# EAGLE design LCD (EAGLE 7.6.0)
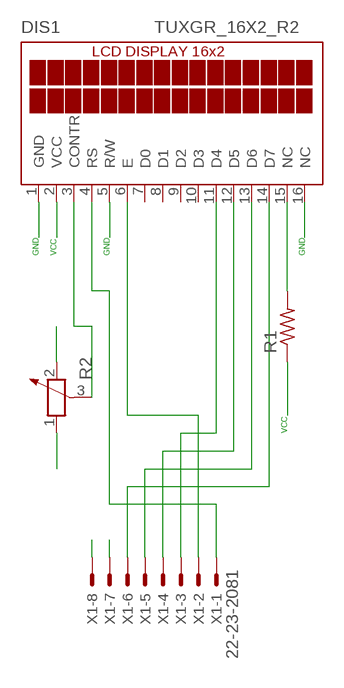
[diagram p0: schematic, sheet 1]

## Parts
DIS1  TUXGR_16X2_R2  [TUXGR_16X2_R2]
R1  R-US_0204/7  [0204/7]
R2  POTENTIOMETER_PT-10  [PT-10]
X1  22-23-2081  [22-23-2081]

## Nets
GND: DIS1.1(GND) DIS1.5(R/W) DIS1.16(NC) R2.1 X1.7
N$1: DIS1.3(CONTR) R2.3
N$2: DIS1.15(NC) R1.2
N$3: DIS1.14(D7) X1.6
N$4: DIS1.13(D6) X1.5
N$5: DIS1.12(D5) X1.4
N$6: DIS1.11(D4) X1.3
N$7: DIS1.6(E) X1.2
N$8: DIS1.4(RS) X1.1
VCC: DIS1.2(VCC) R1.1 R2.2 X1.8
Unconnected: DIS1.7(D0) DIS1.8(D1) DIS1.9(D2) DIS1.10(D3)

## Notes on the sheet
- GND | VCC | GND | GND
- VCC

## Library data of the parts
DIS1 = display-lcd:TUXGR_16X2_R2: Tuxgraphics LCD display 16x2 characters reflective, without background light Source: tuxgr_12x2_r2.pdf; OC_FARNELL: unknown; OC_NEWARK: unknown
R1 = resistor:R-US_: RESISTOR, American symbol
R2 = rcl:POTENTIOMETER_: Potentiometer
X1 = con-molex:22-23-2081: .100" (2.54mm) Center Header - 8 Pin; MF: MOLEX; MPN: 22-23-2081; OC_FARNELL: 1756826; OC_NEWARK: 01C7592

## Net classes
0 default: width 1.016 mm, drill 1.016 mm, clearance 1.016 mm

## Board
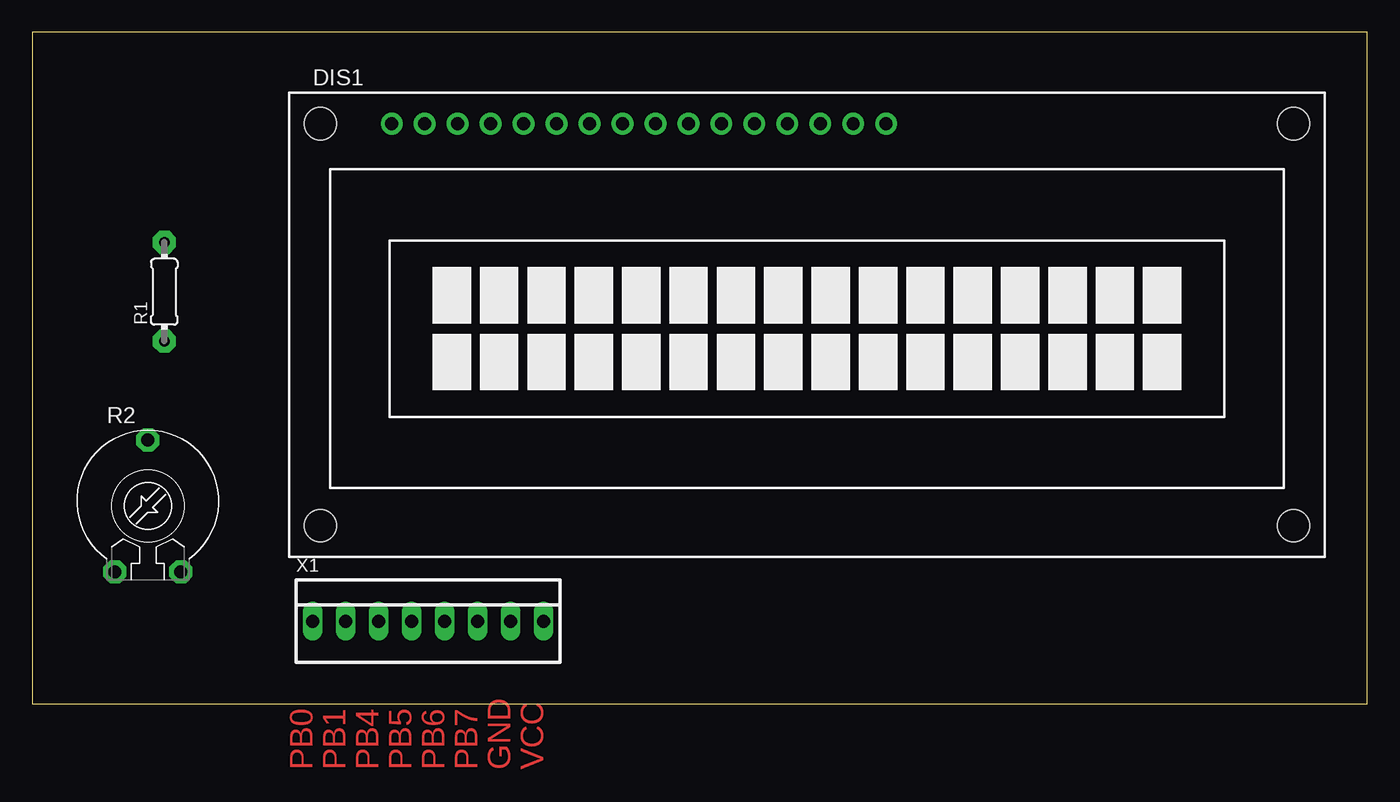
[diagram p1: board, top side]
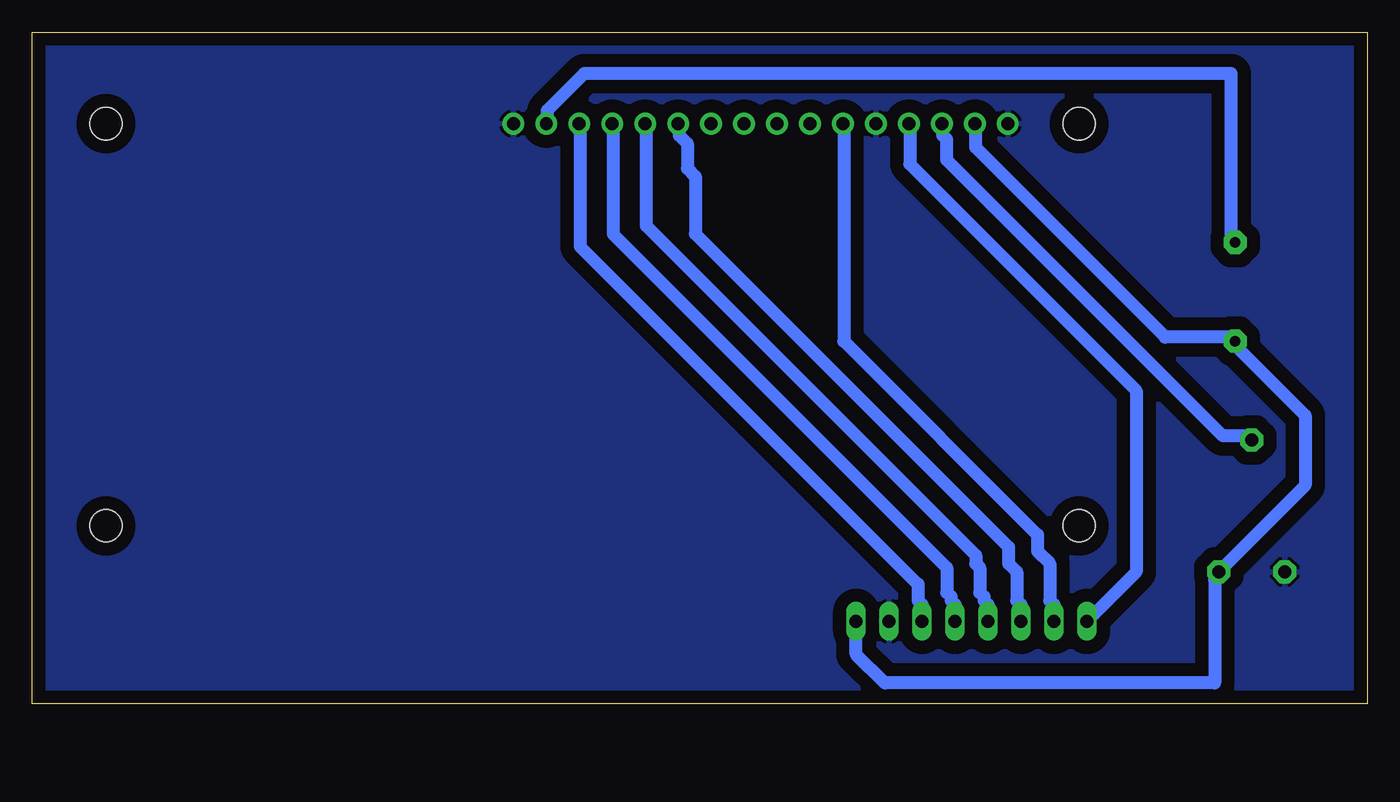
[diagram p2: board, bottom side, seen from below]

Size 102.85 x 51.74 mm. Coordinates in mm from the lower left corner, seen from the top.
Outline: 0,0 102.85,0 102.85,51.74 0,51.74 0,0
Copper layers (1*16): Top 0.035mm / dielectric 1.5mm / Bottom 0.035mm
Design rules "default": minimum track width 10mil, minimum drill 24mil, track to track 8mil, track to pad 8mil, pad to pad 8mil, via to via 8mil, smd to smd 8mil, copper to edge 40mil, drill to drill 8mil, minimum pad ring 10mil, minimum via ring 8mil, stop-mask expansion 4mil, vias tented up to drill 0mil, thermal gap 10mil

### Footprints (pad centres in the part's own frame; a part is rotated, then mirrored left to right if it is on the bottom)
TUXGR_16X2_R2 = drill 1 pad 1.676: 1 -32,15.5; 2 -29.46,15.5; 3 -26.92,15.5; 4 -24.38,15.5; 5 -21.84,15.5; 6 -19.3,15.5; 7 -16.76,15.5; 8 -14.22,15.5; 9 -11.68,15.5; 10 -9.14,15.5; 11 -6.6,15.5; 12 -4.06,15.5; 13 -1.52,15.5; 14 1.02,15.5; 15 3.56,15.5; 16 6.1,15.5 | hole 2.5: -37.5,-15.5; 37.5,-15.5; -37.5,15.5; 37.5,15.5
0204/7 = drill 0.813 pad 1.778 octagon: 1 -3.81,0; 2 3.81,0
PT-10 = drill 1.016 pad 1.778 octagon: 1 -2.54,-5.08; 2 2.54,-5.08; 3 0,5.08
22-23-2081 = drill 1 long: 1 -8.89,0; 2 -6.35,0; 3 -3.81,0; 4 -1.27,0; 5 1.27,0; 6 3.81,0; 7 6.35,0; 8 8.89,0

### Placement (x,y rotation side)
DIS1  59.69,29.21 0 top
R1  10.16,31.75 90 top
R2  8.89,15.24 0 top
X1  30.48,6.35 0 top

### Tracks (layer width: path | path; a pad name or v marks a point on that pad's centre or on a via)
GND
  pour Bottom: 0,52.07 102.87,52.07 102.87,0 0,0
N$1
  Bottom 1.016: R2.3 8.89,20.64 11.11,20.64 32.38,41.91 32.38,43.5 32.7,43.81 32.7,44.45 DIS1.3
N$2
  Bottom 1.016: R1.2 10.16,35.88 10.48,36.2 10.48,48.58 60.33,48.58 63.18,45.72 63.18,44.77 DIS1.15
N$3
  Bottom 1.016: X1.6 34.29,7.62 34.61,7.94 34.61,9.21 60.64,35.24 60.64,44.45 DIS1.14
N$4
  Bottom 1.016: X1.5 31.75,7.62 32.07,7.94 32.07,8.26 32.38,8.57 32.38,10.48 58.1,36.2 58.1,44.45 DIS1.13
N$5
  Bottom 1.016: X1.4 29.21,7.62 29.53,7.94 29.53,8.26 29.84,8.57 29.84,10.48 30.16,10.8 30.16,11.43 55.56,36.83 55.56,44.45 DIS1.12
N$6
  Bottom 1.016: X1.3 26.67,7.62 26.99,7.94 26.99,10.16 27.62,10.8 27.62,12.06 51.75,36.2 51.75,40.64 52.39,41.28 52.39,43.18 53.02,43.81 53.02,44.45 DIS1.11
N$7
  Bottom 1.016: X1.2 24.13,7.62 24.45,7.94 24.45,10.8 25.4,11.75 25.4,13.02 40.32,27.94 40.32,44.45 DIS1.6
N$8
  Bottom 1.016: X1.1 17.78,10.16 17.78,24.13 35.24,41.59 35.24,44.45 DIS1.4
VCC
  Bottom 1.016: X1.8 39.37,3.81 37.15,1.59 11.75,1.59 11.75,9.52 11.43,9.84 R2.2 4.76,16.83 4.76,22.22 9.84,27.31 9.84,27.62 R1.1 10.16,28.26 15.56,28.26 30.16,42.86 30.16,44.45 DIS1.2

### Text on the board
Top: PB0 | PB1 | PB4 | PB5 | PB6 | PB7 | GND | VCC